# EAGLE design all (EAGLE 7.7.0)
AUTHOR: Pero Krivic

## Sheet 1 of 2
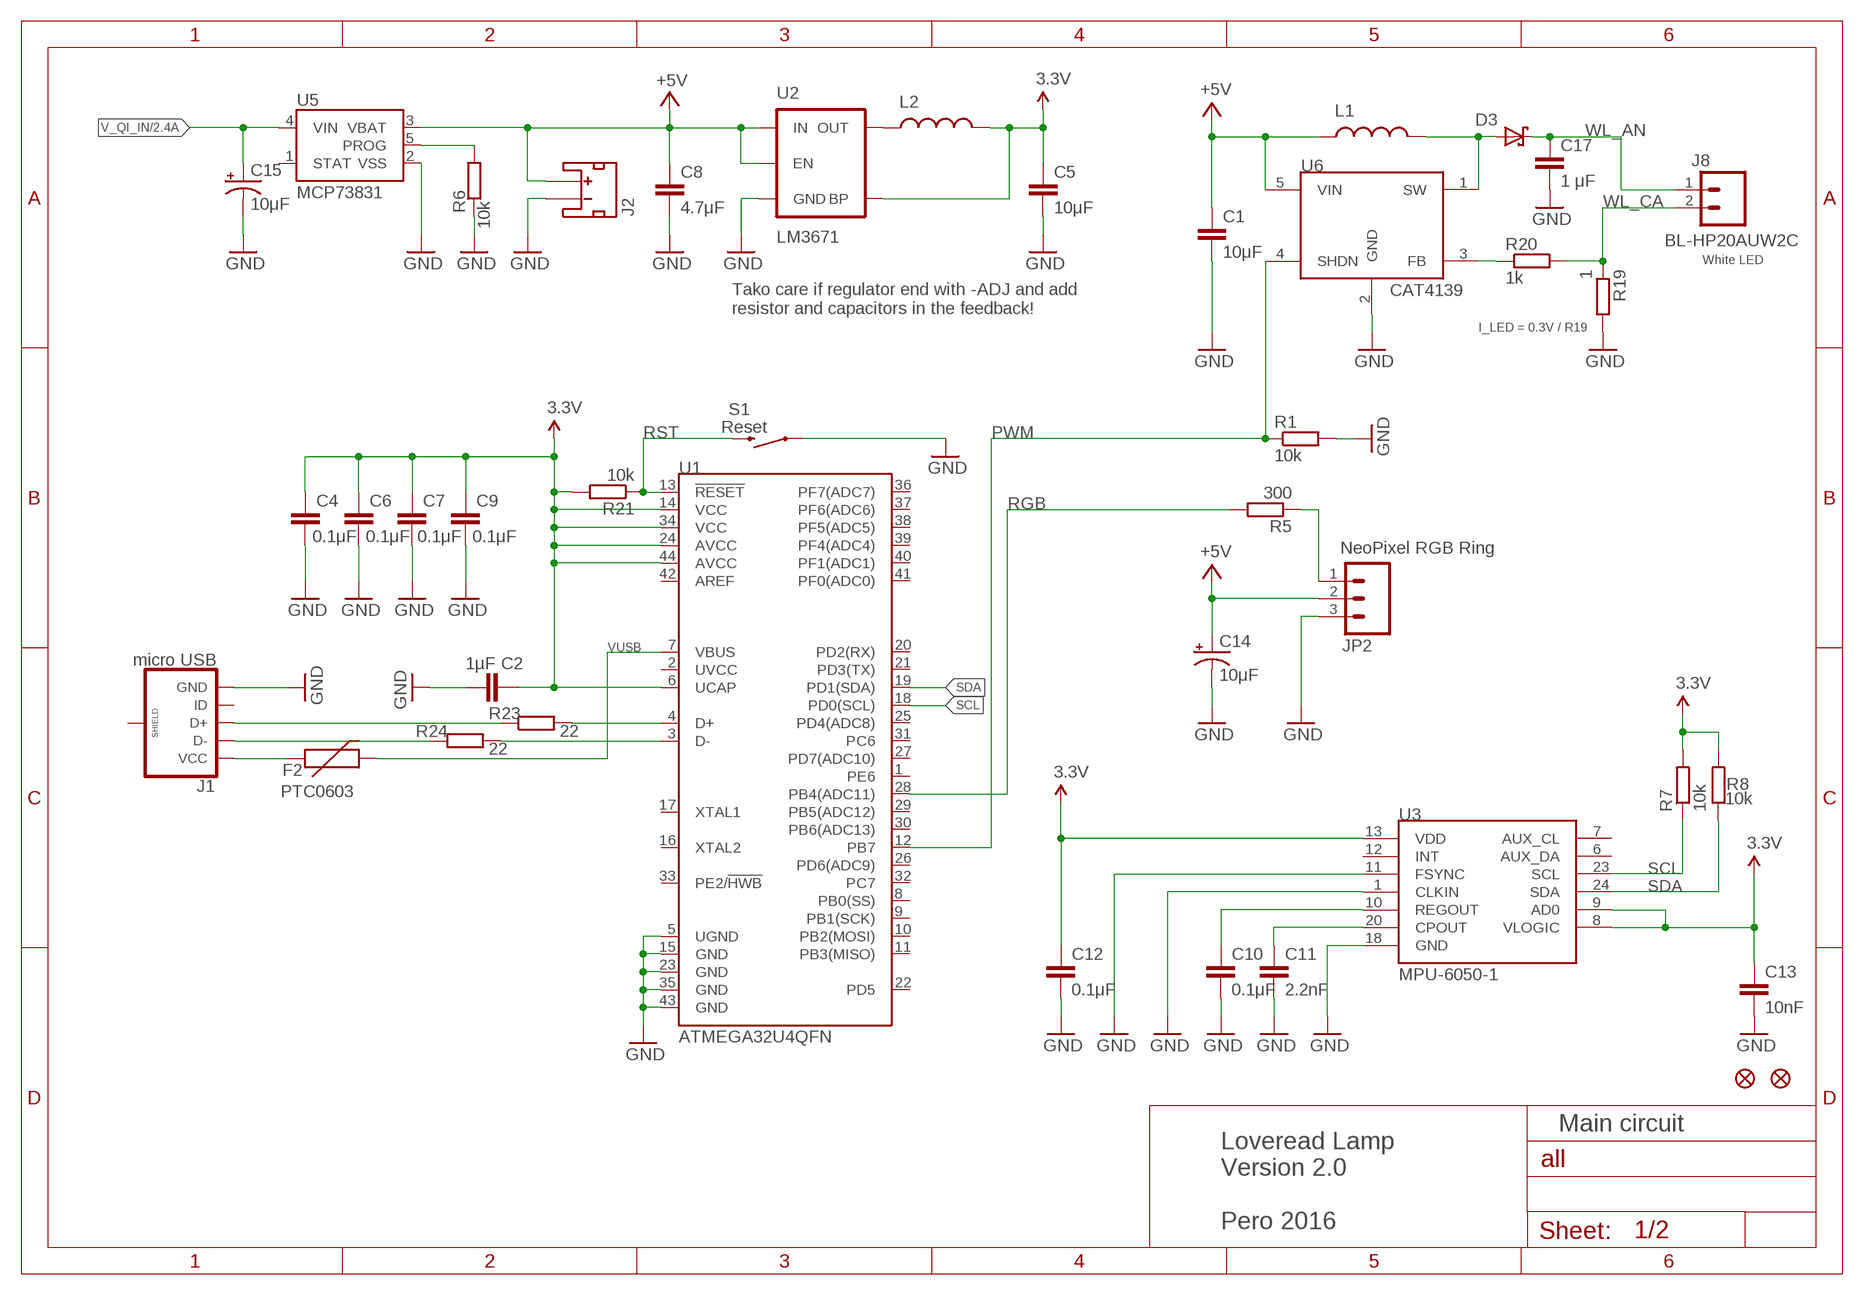
[diagram p0: schematic, sheet 1]

### Parts
C1  10μF  C-EUC0603K  [C0603K]
C2  1µF  C-EUC0603  [C0603]
C4  0.1μF  C-EUC0603K  [C0603K]
C5  10μF  C-EUC0603K  [C0603K]
C6  0.1μF  C-EUC0603K  [C0603K]
C7  0.1μF  C-EUC0603K  [C0603K]
C8  4.7μF  C-EUC0603K  [C0603K]
C9  0.1μF  C-EUC0603K  [C0603K]
C10  0.1μF  C-EUC0603K  [C0603K]
C11  2.2nF  C-EUC0603K  [C0603K]
C12  0.1μF  C-EUC0603K  [C0603K]
C13  10nF  C-EUC0603K  [C0603K]
C14  10μF  CAP_POL1206  [EIA3216]
C15  10μF  CAP_POL1206  [EIA3216]
C17  1 μF  C-EUC0603K  [C0603K]
D3  SMF5.0AT1  [SOD123FL]
F2  PTC0603  [0603]
FD1  FIDUCIAL1X2  [FIDUCIAL-1X2]
FD2  FIDUCIAL1X2  [FIDUCIAL-1X2]
J1  micro USB  USB_MICROB_PLUGCONN-11752  [USB-B-MICRO-SMD_V03]
J2  LIPO-BATTERY-CONNECTOR  [JST-LIPO-CONNECTOR-1.25MM]
J8  BL-HP20AUW2C  M02PTH  [1X02]
JP2  NeoPixel RGB Ring  M03PTH  [1X03]
L1  22uH  INDUCTORSDR0403-560KL  [SDR0403]
L2  2.2uH  INDUCTORSDR0403-560KL  [SDR0403]
R1  10k  R-EU_R0603  [R0603]
R5  300  R-EU_R0603  [R0603]
R6  10k  R-EU_R0603  [R0603]
R7  10k  R-EU_R0603  [R0603]
R8  10k  R-EU_R0603  [R0603]
R19  1  R-EU_R0603  [R0603]
R20  1k  R-EU_R0603  [R0603]
R21  10k  R-EU_R0603  [R0603]
R23  22  R-EU_R0603  [R0603]
R24  22  R-EU_R0603  [R0603]
S1  Reset  SWITCH-BUTTON-SKSGAAE010  [TACTILE-SWITCH-SKSGAAE010]
U1  ATMEGA32U4QFN  [QFN-44]
U2  LM3671  LM36713.3V  [SOT23-5]
U3  MPU-6050-1  [QFN-24-4MM2]
U5  MCP73831  [SOT23-5]
U6  CAT4139  [SOT23-5]

### Nets
3.3V: C2.1 C4.1 C5.1 C6.1 C7.1 C9.1 C12.1 C13.1 L2.P$2 R7.2 R8.2 R21.2 U1.6(UCAP) U1.14(VCC) U1.24(AVCC) U1.34(VCC) U1.44(AVCC) U2.4(BP) U3.8(VLOGIC) U3.9(AD0) U3.13(VDD)
+5V: C1.1 C8.1 C14.A(+) J2.P$1(+) JP2.2 L1.P$1 U2.1(IN) U2.3(EN) U5.3(VBAT) U6.5(VIN)
GND: C1.2 C2.2 C4.2 C5.2 C6.2 C7.2 C8.2 C9.2 C10.2 C11.2 C12.2 C13.2 C14.C(-) C15.C(-) C17.2 J1.GND J2.P$2(-) JP2.3 R1.2 R6.1 R19.2 S1.P$1 S1.P$3 U1.5(UGND) U1.15(GND) U1.23(GND) U1.35(GND) U1.43(GND) U2.2(GND) U3.1(CLKIN) U3.11(FSYNC) U3.18(GND) U5.2(VSS) U6.2(GND) ; also sheet 2
N$1: C11.1 U3.20(CPOUT)
N$5: C10.1 U3.10(REGOUT)
N$15: JP2.1 R5.1
N$17: R6.2 U5.5(PROG)
N$63: D3.A L1.P$2 U6.1(SW)
N$65: R20.1 U6.3(FB)
N$66: L2.P$1 U2.5(OUT)
N$73: F2.1 J1.VBUS(VCC)
N$74: J1.D+ R23.1
N$78: J1.D- R24.1
N$80: R23.2 U1.4(D+)
N$81: R24.2 U1.3(D-)
PWM: R1.1 U1.12(PB7) U6.4(SHDN)
RGB: R5.2 U1.28(PB4(ADC11))
RST: R21.1 S1.P$2 S1.P$4 U1.13(!RESET)
SCL: R7.1 U1.18(PD0(SCL)) U3.23(SCL)
SDA: R8.1 U1.19(PD1(SDA)) U3.24(SDA)
V_QI_IN: C15.A(+) U5.4(VIN) ; also sheet 2
VUSB: F2.2 U1.7(VBUS)
WL_AN: C17.1 D3.C J8.1
WL_CA: J8.2 R19.1 R20.2
Unconnected: J1.ID J1.SHIELD1(SHIELD) J1.SHIELD2(SHIELD) J1.SHIELD3(SHIELD) J2.P$3(PAD1) J2.P$4(PAD2) U1.1(PE6) U1.2(UVCC) U1.8(PB0(SS)) U1.9(PB1(SCK)) U1.10(PB2(MOSI)) U1.11(PB3(MISO)) U1.16(XTAL2) U1.17(XTAL1) U1.20(PD2(RX)) U1.21(PD3(TX)) U1.22(PD5) U1.25(PD4(ADC8)) U1.26(PD6(ADC9)) U1.27(PD7(ADC10)) U1.29(PB5(ADC12)) U1.30(PB6(ADC13)) U1.31(PC6) U1.32(PC7) U1.33(PE2/!HWB) U1.36(PF7(ADC7)) U1.37(PF6(ADC6)) U1.38(PF5(ADC5)) U1.39(PF4(ADC4)) U1.40(PF1(ADC1)) U1.41(PF0(ADC0)) U1.42(AREF) U3.6(AUX_DA) U3.7(AUX_CL) U3.12(INT) U5.1(STAT)

### Notes on the sheet
- White LED
- Tako care if regulator end with -ADJ and add
  resistor and capacitors in the feedback!
- I_LED = 0.3V / R19
- Main circuit
- Loveread Lamp
  Version 2.0
  
  Pero 2016

## Sheet 2 of 2
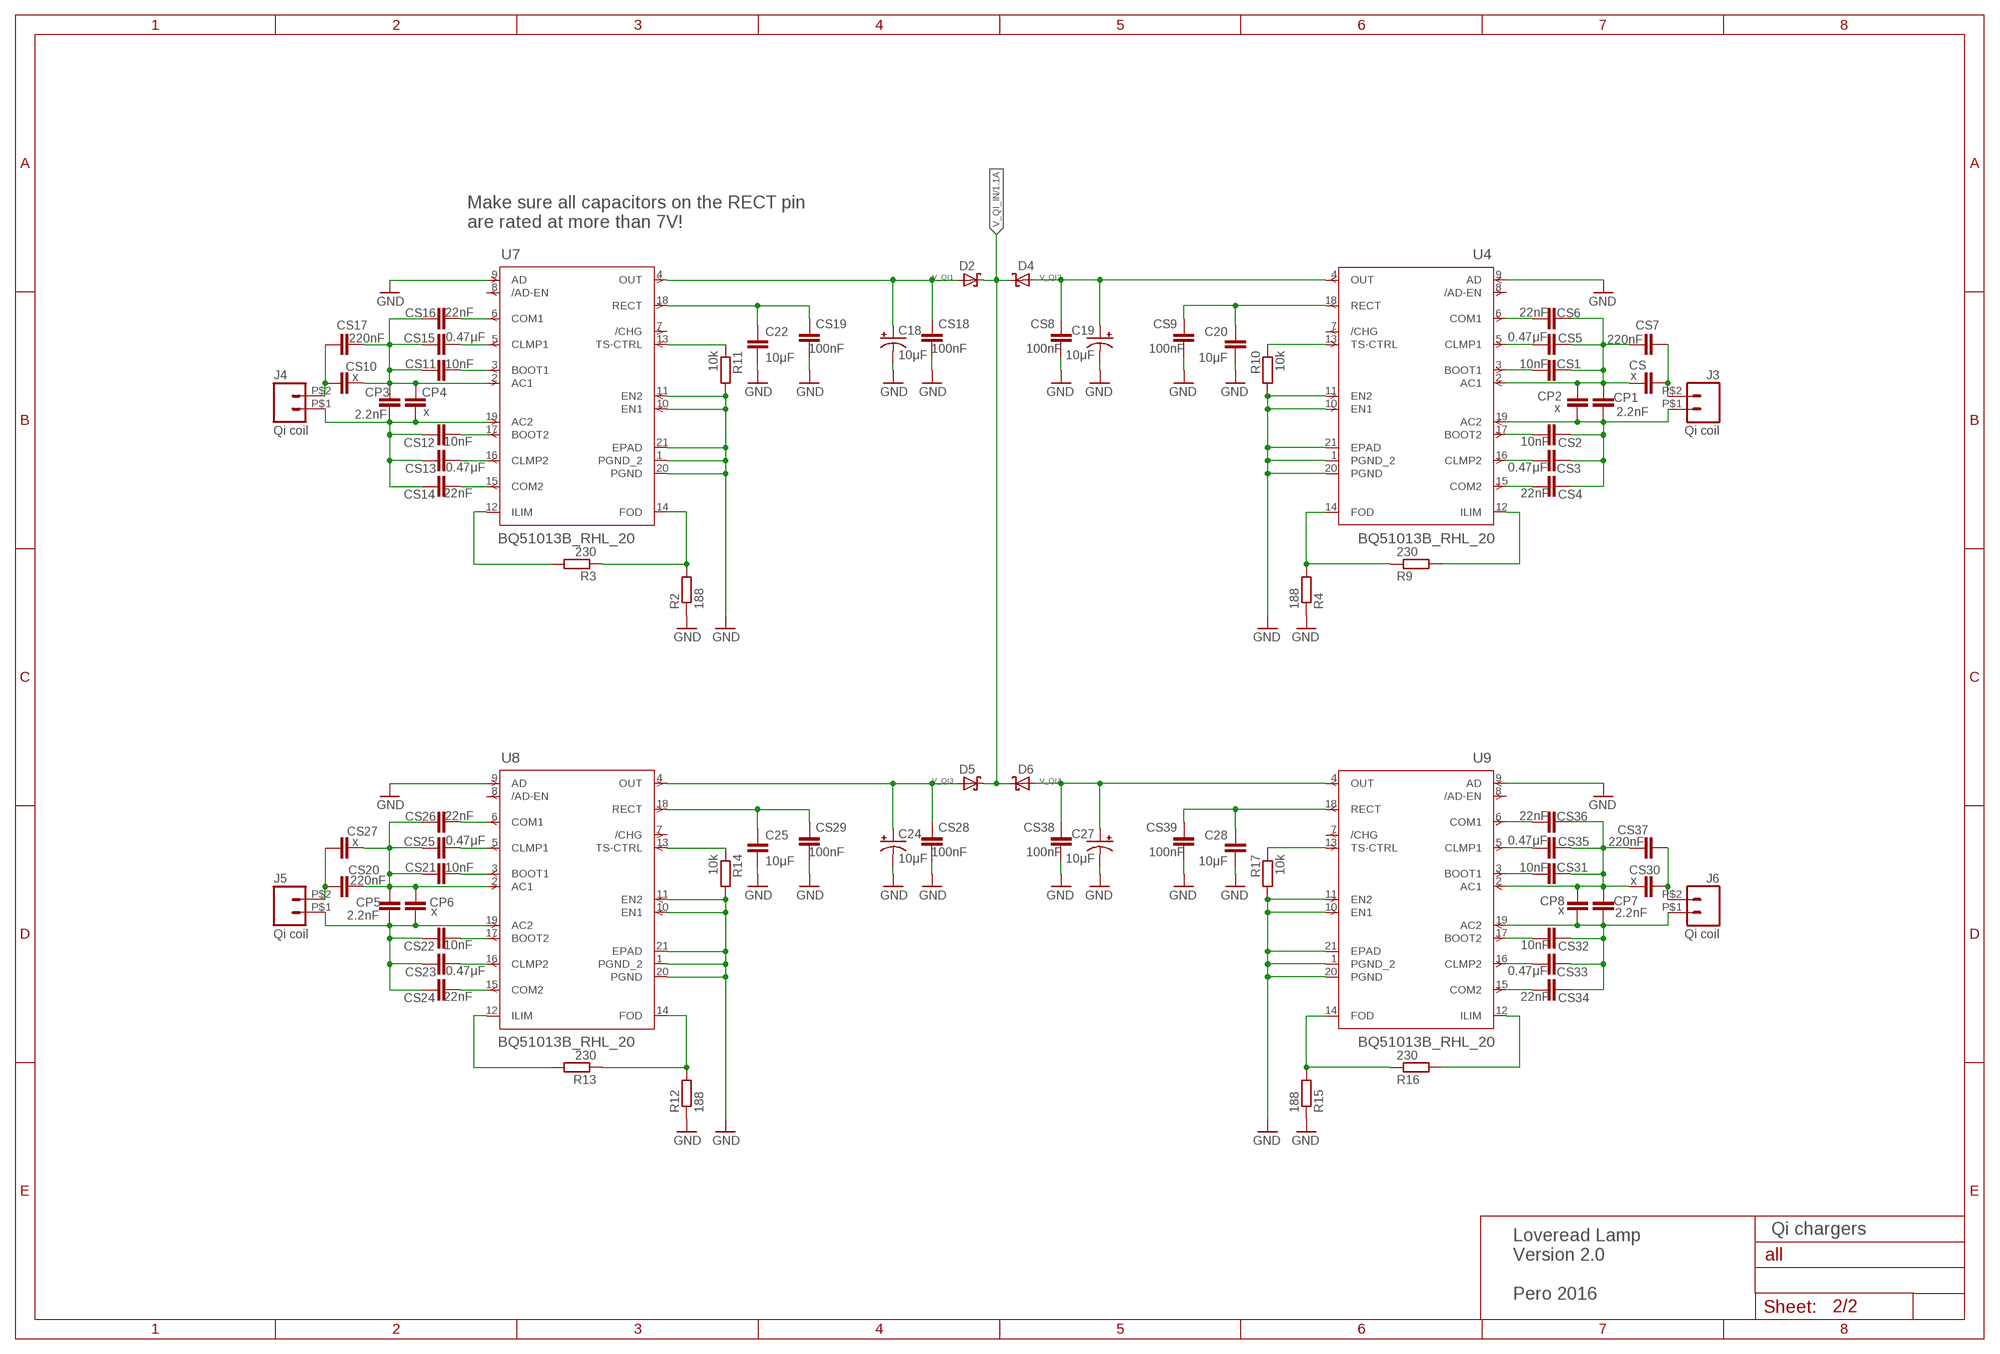
[diagram p1: schematic, sheet 2]

### Parts
C18  10μF  CAP_POL1206  [EIA3216]
C19  10μF  CAP_POL1206  [EIA3216]
C20  10μF  C-EUC0603K  [C0603K]
C22  10μF  C-EUC0603K  [C0603K]
C24  10μF  CAP_POL1206  [EIA3216]
C25  10μF  C-EUC0603K  [C0603K]
C27  10μF  CAP_POL1206  [EIA3216]
C28  10μF  C-EUC0603K  [C0603K]
CP1  2.2nF  C-EUC0603K  [C0603K]
CP2  x  C-EUC0603K  [C0603K]
CP3  2.2nF  C-EUC0603K  [C0603K]
CP4  x  C-EUC0603K  [C0603K]
CP5  2.2nF  C-EUC0603K  [C0603K]
CP6  x  C-EUC0603K  [C0603K]
CP7  2.2nF  C-EUC0603K  [C0603K]
CP8  x  C-EUC0603K  [C0603K]
CS  x  C-EUC0603K  [C0603K]
CS1  10nF  C-EUC0603K  [C0603K]
CS2  10nF  C-EUC0603K  [C0603K]
CS3  0.47μF  C-EUC0603K  [C0603K]
CS4  22nF  C-EUC0603K  [C0603K]
CS5  0.47μF  C-EUC0603K  [C0603K]
CS6  22nF  C-EUC0603K  [C0603K]
CS7  220nF  C-EUC0603K  [C0603K]
CS8  100nF  C-EUC0603K  [C0603K]
CS9  100nF  C-EUC0603K  [C0603K]
CS10  x  C-EUC0603K  [C0603K]
CS11  10nF  C-EUC0603K  [C0603K]
CS12  10nF  C-EUC0603K  [C0603K]
CS13  0.47μF  C-EUC0603K  [C0603K]
CS14  22nF  C-EUC0603K  [C0603K]
CS15  0.47μF  C-EUC0603K  [C0603K]
CS16  22nF  C-EUC0603K  [C0603K]
CS17  220nF  C-EUC0603K  [C0603K]
CS18  100nF  C-EUC0603  [C0603]
CS19  100nF  C-EUC0603K  [C0603K]
CS20  220nF  C-EUC0603K  [C0603K]
CS21  10nF  C-EUC0603K  [C0603K]
CS22  10nF  C-EUC0603K  [C0603K]
CS23  0.47μF  C-EUC0603K  [C0603K]
CS24  22nF  C-EUC0603K  [C0603K]
CS25  0.47μF  C-EUC0603K  [C0603K]
CS26  22nF  C-EUC0603K  [C0603K]
CS27  x  C-EUC0603K  [C0603K]
CS28  100nF  C-EUC0603K  [C0603K]
CS29  100nF  C-EUC0603K  [C0603K]
CS30  x  C-EUC0603K  [C0603K]
CS31  10nF  C-EUC0603K  [C0603K]
CS32  10nF  C-EUC0603K  [C0603K]
CS33  0.47μF  C-EUC0603K  [C0603K]
CS34  22nF  C-EUC0603K  [C0603K]
CS35  0.47μF  C-EUC0603K  [C0603K]
CS36  22nF  C-EUC0603K  [C0603K]
CS37  220nF  C-EUC0603K  [C0603K]
CS38  100nF  C-EUC0603K  [C0603K]
CS39  100nF  C-EUC0603K  [C0603K]
D2  SMF5.0AT1  [SOD123FL]
D4  SMF5.0AT1  [SOD123FL]
D5  SMF5.0AT1  [SOD123FL]
D6  SMF5.0AT1  [SOD123FL]
J3  Qi coil  M02PTH2  [1X02_BIG]
J4  Qi coil  M02PTH2  [1X02_BIG]
J5  Qi coil  M02PTH2  [1X02_BIG]
J6  Qi coil  M02PTH2  [1X02_BIG]
R2  188  R-EU_R0603  [R0603]
R3  230  R-EU_R0603  [R0603]
R4  188  R-EU_R0603  [R0603]
R9  230  R-EU_R0603  [R0603]
R10  10k  R-EU_R0603  [R0603]
R11  10k  R-EU_R0603  [R0603]
R12  188  R-EU_R0603  [R0603]
R13  230  R-EU_R0603  [R0603]
R14  10k  R-EU_R0603  [R0603]
R15  188  R-EU_R0603  [R0603]
R16  230  R-EU_R0603  [R0603]
R17  10k  R-EU_R0603  [R0603]
U4  BQ51013B_RHL_20  [RHL20_2P05X3P05]
U7  BQ51013B_RHL_20  [RHL20_2P05X3P05]
U8  BQ51013B_RHL_20  [RHL20_2P05X3P05]
U9  BQ51013B_RHL_20  [RHL20_2P05X3P05]

### Nets
GND: C18.C(-) C19.C(-) C20.2 C22.2 C24.C(-) C25.2 C27.C(-) C28.2 CS8.2 CS9.2 CS18.2 CS19.2 CS28.2 CS29.2 CS38.2 CS39.2 R2.1 R4.1 R10.2 R11.2 R12.1 R14.2 R15.1 R17.2 U4.1(PGND_2) U4.9(AD) U4.10(EN1) U4.11(EN2) U4.20(PGND) U4.21(EPAD) U7.1(PGND_2) U7.9(AD) U7.10(EN1) U7.11(EN2) U7.20(PGND) U7.21(EPAD) U8.1(PGND_2) U8.9(AD) U8.10(EN1) U8.11(EN2) U8.20(PGND) U8.21(EPAD) U9.1(PGND_2) U9.9(AD) U9.10(EN1) U9.11(EN2) U9.20(PGND) U9.21(EPAD) ; also sheet 1
N$6: CS10.1 CS17.1 J4.P$2
N$8: CP3.1 CP4.1 CS12.1 CS13.1 CS14.1 J4.P$1 U7.19(AC2)
N$9: CP1.2 CP2.2 CS1.1 CS5.1 CS6.1 CS7.2 CS.2 U4.2(AC1)
N$10: CS7.1 CS.1 J3.P$2
N$11: CP1.1 CP2.1 CS2.1 CS3.1 CS4.1 J3.P$1 U4.19(AC2)
N$12: CS1.2 U4.3(BOOT1)
N$13: CS2.2 U4.17(BOOT2)
N$14: CS3.2 U4.16(CLMP2)
N$16: CS11.2 U7.3(BOOT1)
N$19: CS4.2 U4.15(COM2)
N$20: CS6.2 U4.6(COM1)
N$21: CS5.2 U4.5(CLMP1)
N$22: CS12.2 U7.17(BOOT2)
N$23: C20.1 CS9.1 U4.18(RECT)
N$24: R9.2 U4.12(ILIM)
N$25: R4.2 R9.1 U4.14(FOD)
N$26: R10.1 U4.13(TS-CTRL)
N$27: CS13.2 U7.16(CLMP2)
N$28: CS14.2 U7.15(COM2)
N$29: CS16.2 U7.6(COM1)
N$30: CS15.2 U7.5(CLMP1)
N$31: CP3.2 CP4.2 CS10.2 CS11.1 CS15.1 CS16.1 CS17.2 U7.2(AC1)
N$32: C22.1 CS19.1 U7.18(RECT)
N$33: R3.2 U7.12(ILIM)
N$34: R2.2 R3.1 U7.14(FOD)
N$35: R11.1 U7.13(TS-CTRL)
N$36: CS20.1 CS27.1 J5.P$2
N$37: CP5.1 CP6.1 CS22.1 CS23.1 CS24.1 J5.P$1 U8.19(AC2)
N$38: CS21.2 U8.3(BOOT1)
N$39: CS22.2 U8.17(BOOT2)
N$40: CS23.2 U8.16(CLMP2)
N$41: CS24.2 U8.15(COM2)
N$42: CS26.2 U8.6(COM1)
N$43: CS25.2 U8.5(CLMP1)
N$44: CP5.2 CP6.2 CS20.2 CS21.1 CS25.1 CS26.1 CS27.2 U8.2(AC1)
N$45: C25.1 CS29.1 U8.18(RECT)
N$46: R13.2 U8.12(ILIM)
N$47: R12.2 R13.1 U8.14(FOD)
N$48: R14.1 U8.13(TS-CTRL)
N$49: CS30.1 CS37.1 J6.P$2
N$50: CP7.1 CP8.1 CS32.1 CS33.1 CS34.1 J6.P$1 U9.19(AC2)
N$51: CS31.2 U9.3(BOOT1)
N$52: CS32.2 U9.17(BOOT2)
N$53: CS33.2 U9.16(CLMP2)
N$54: CS34.2 U9.15(COM2)
N$55: CS36.2 U9.6(COM1)
N$56: CS35.2 U9.5(CLMP1)
N$57: CP7.2 CP8.2 CS30.2 CS31.1 CS35.1 CS36.1 CS37.2 U9.2(AC1)
N$58: C28.1 CS39.1 U9.18(RECT)
N$59: R16.2 U9.12(ILIM)
N$60: R15.2 R16.1 U9.14(FOD)
N$61: R17.1 U9.13(TS-CTRL)
V_QI1: C18.A(+) CS18.1 D2.A U7.4(OUT)
V_QI2: C19.A(+) CS8.1 D4.A U4.4(OUT)
V_QI3: C24.A(+) CS28.1 D5.A U8.4(OUT)
V_QI4: C27.A(+) CS38.1 D6.A U9.4(OUT)
V_QI_IN: D2.C D4.C D5.C D6.C ; also sheet 1
Unconnected: U4.7(/CHG) U4.8(/AD-EN) U7.7(/CHG) U7.8(/AD-EN) U8.7(/CHG) U8.8(/AD-EN) U9.7(/CHG) U9.8(/AD-EN)

### Notes on the sheet
- Make sure all capacitors on the RECT pin
  are rated at more than 7V!
- Qi chargers
- Loveread Lamp
  Version 2.0
  
  Pero 2016

## Library data of the parts
C1 C2 C4-C13 C17 C20 C22 C25 C28 CP1-CP8 CS CS1-CS39 = rcl:C-EU: CAPACITOR, European symbol
C14 C15 C18 C19 C24 C27 = SparkFun:CAP_POL: Capacitor Polarized These are standard SMD and PTH capacitors. Normally 10uF, 47uF, and 100uF in electrolytic and tantalum varieties. Always verify the external diameter of the through hole cap, it varies with capacity, voltage, and manufacturer. The EIA devices should be standard.
D2-D6 = diode:SMF5.0AT1: 200 W Transient Voltage Suppressor Source: Data sheet <http://www.onsemi.com/pub_link/Collateral/SMF5.0AT1-D.PDF>
F2 = SparkFun-PowerIC:PTC: Resettable Fuse PTC Resettable Fuse. Spark Fun Electronics SKU : COM-08357
FD1 FD2 = SparkFun-Aesthetics:FIDUCIAL: Fiducial Alignment Points Various fiducial points for machine vision alignment.
J1 = SparkFun-Connectors:USB_MICROB_PLUG: USB Micro-B connectors Some male, some female. Watch your step!; PROD_ID: CONN-11752
J2 = pero_library:LIPO-BATTERY-CONNECTOR: LiPo Battery connector, 1 mm raster; MANUFACTURER: JST; RS-NUMBER: 752-1790; SUPPLIER-ID: SM02B-GHS-TB(LF)(SN)
J3-J6 J8 = SparkFun-Connectors:M02: Standard 2-pin 0.1" header. Use with - straight break away headers ( PRT-00116) - right angle break away headers (PRT-00553) - swiss pins (PRT-00743) - machine pins (PRT-00117) - female headers (PRT-00115) Molex polarized connector foot print use with: PRT-08233 with associated crimp pins and housings. 2.54_SCREWTERM for use with PRT-10571. 3.5mm Screw Terminal footprints for PRT-08084 5mm Screw Terminal footprints for use with PRT-08432
JP2 = SparkFun-Connectors:M03: Header 3 Standard 3-pin 0.1" header. Use with straight break away headers (SKU : PRT-00116), right angle break away headers (PRT-00553), swiss pins (PRT-00743), machine pins (PRT-00117), and female headers (PRT-00115). Molex polarized connector foot print use with SKU : PRT-08232 with associated crimp pins and housings.
L1 L2 = SparkFun-Passives:INDUCTOR: Inductors Basic Inductor/Choke - 0603 and 1206. Footprints are not proven and vary greatly between part numbers. INDUCTOR POWER 3.3UH 4.0A SMD 0.197" L x 0.197" W x 0.177" H (5.00mm x 5.00mm x 4.50mm); DIST: DIGIKEY; DIST_ID: SDR0403-560KLCT-ND; VALUE: 56uH
R1 R19 R20 = resistor:R-EU_: RESISTOR, European symbol
R2-R17 R21 R23 R24 = rcl:R-EU_: RESISTOR, European symbol
S1 = pero_library:SWITCH-BUTTON-SKSGAAE010: 1-Pole Switch-button SKSGAAE010 Dimensions: 3 x 2.7mm Max. current: 50 mA; MANUFACTURER: Alps; PRODUCT-ID: SKSGAAE010; RS-NUMBER: 917-3829
U1 = SparkFun-DigitalIC:ATMEGA32U4: Atmel 44-pin 8-bit Microcontroller with 32KBytes of ISP Flash and USB Controller
U2 = pero_library:LM3671: LM3671/-Q1 2-MHz, 600-mA Step-Down DC-DC Converter; MANUFACTURER: Texas Instruments; PROD_ID: VREG-00822; RS-NUMBER: 537-9547
U3 = Testing:MPU-6050
U4 U7-U9 = pero_library:BQ51013B_RHL_20; DATASHEETURL: http://www.ti.com/lit/gpn/BQ51013B; DESCRIPTION: WPC 1.1 Compatible Fully Integrated Wireless Power Receiver IC; FAMILY_NAME: Wireless Power - Receiver Solutions; GENERIC_PART_NUMBER: BQ51013B; INDUSTRY_STD_PKG_TYPE: QFN; MANUFACTURER: Texas Instruments; MANUFACTURER_PART_NUMBER: bq51013b_rhl_20; PACKAGE_DESIGNATOR: RHL; PIN_COUNT: 20; VENDOR: Texas Instruments
U5 = SparkFun-PowerIC:MCP73831: Miniature single cell, fully integrated Li-Ion, Li-polymer charge management controller http://ww1.microchip.com/downloads/en/DeviceDoc/20001984g.pdf IC-09995; PROD_ID: IC-09995
U6 = pero_library:CAT4139: The CAT4139 is a DC/DC step−up converter that delivers an accurate constant current ideal for driving LEDs. • Switch Current Limit 750 mA • Drives LED Strings up to 22 V • Up to 87% Efficiency • Low Quiescent Ground Current 0.6 mA • 1 MHz Fixed Frequency Low Noise Operation • Soft Start “In−rush” Current Limiting • Shutdown Current Less than 1 A • Open LED Overvoltage Protection • Automatic Shutdown at 1.9 V (UVLO) • Thermal Overload Protection • TSOT−23 5−Lead (1 mm Max Height) • These Devices are Pb−Free, Halogen Free/BFR Free and are RoHS Compliant; MANUFACTURER: On Semiconductor; RS-NUMBER: 789-3840

## Board
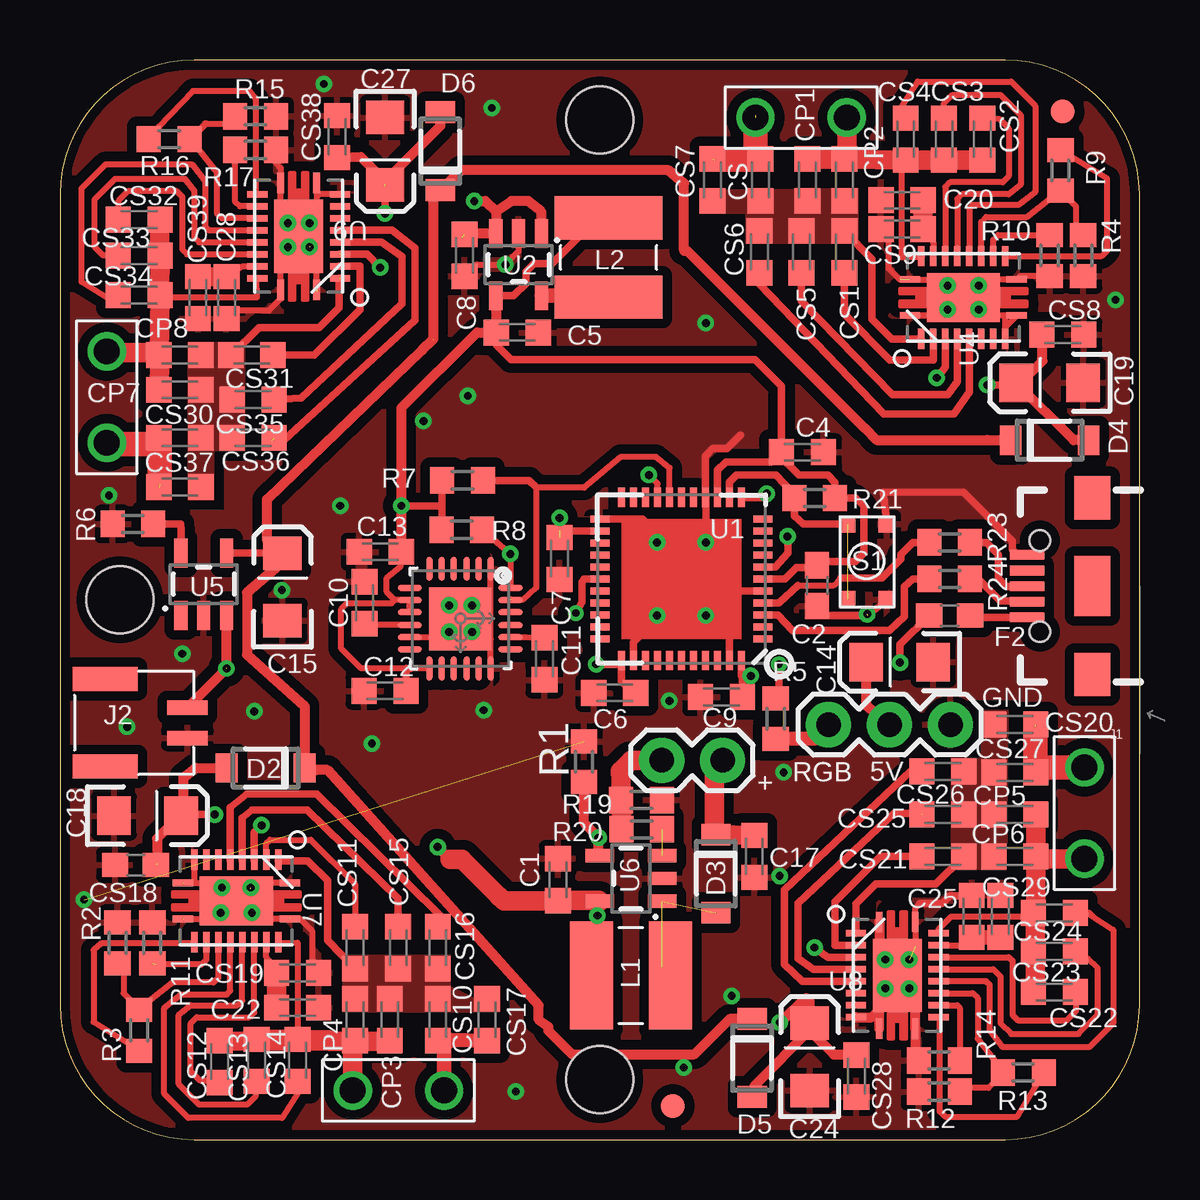
[diagram p2: board, top side]
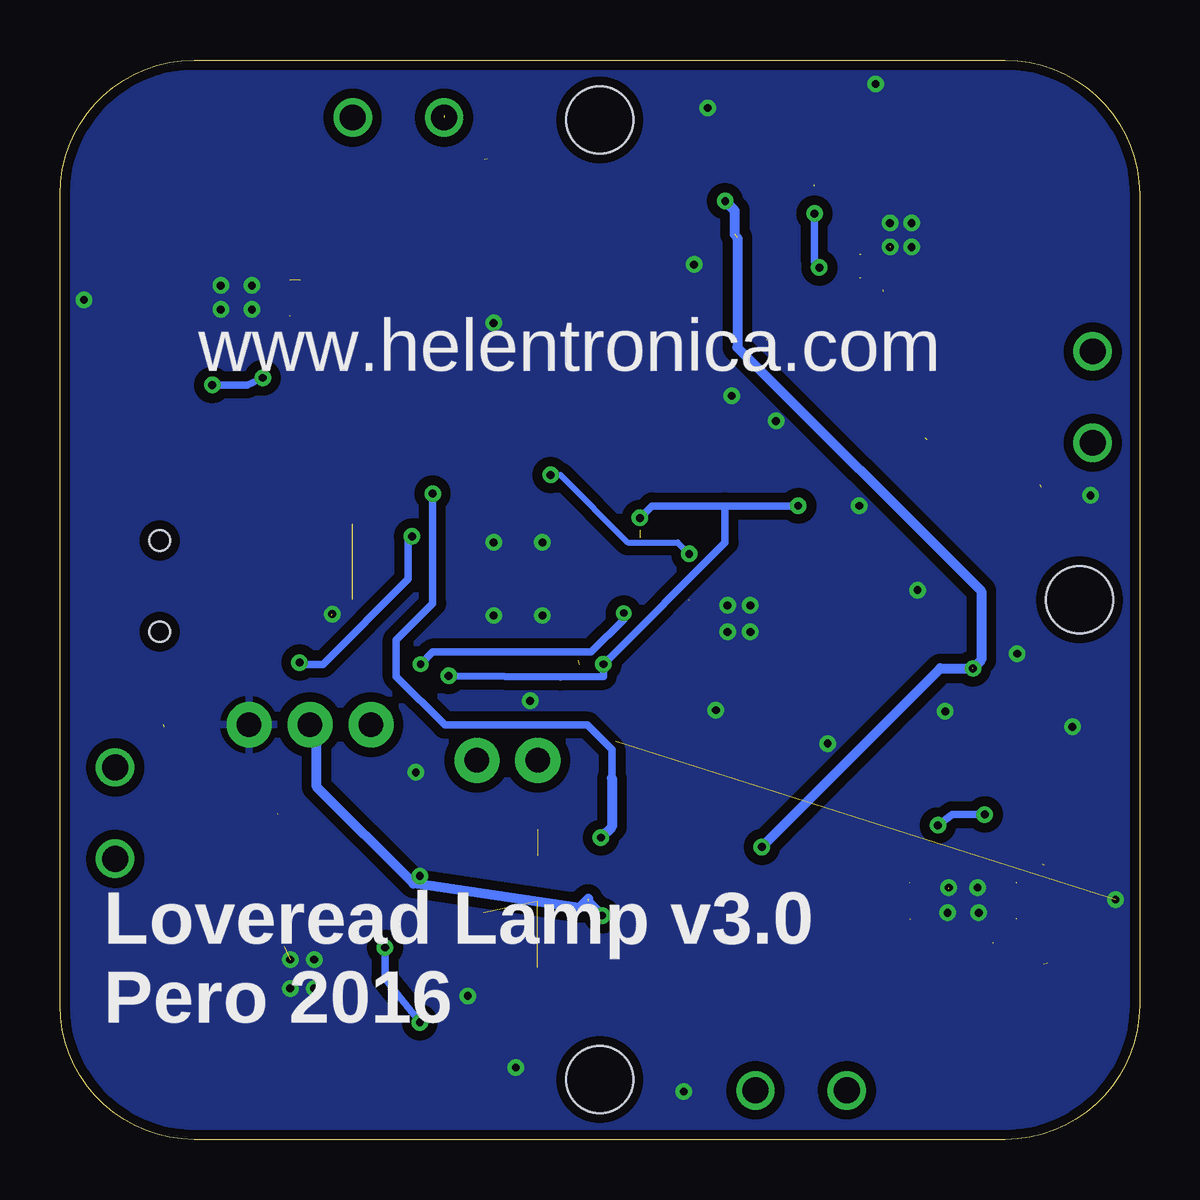
[diagram p3: board, bottom side, seen from below]

Size 45 x 45 mm. Coordinates in mm from the lower left corner, seen from the top.
Outline: 5.59,0 39.41,0 arc90 45,5.59 45,39.41 arc90 39.41,45 5.59,45 arc90 0,39.41 0,5.59 arc90 5.59,0
Copper layers (1*16): Top 0.0356mm / dielectric 1.5011mm / Bottom 0.0356mm
Design rules "LaenPCBOrder": minimum track width 6mil, minimum drill 13mil, track to track 6mil, track to pad 6mil, pad to pad 6mil, via to via 6mil, smd to smd 6mil, copper to edge 15mil, drill to drill 6mil, minimum pad ring 7mil, minimum via ring 7mil, stop-mask expansion 3mil, vias tented up to drill 0mil, thermal gap 10mil
Holes 2.8 mm at 22.5,2.5 22.5,42.5 2.5,22.5

### Footprints (pad centres in the part's own frame; a part is rotated, then mirrored left to right if it is on the bottom)
C0603K = smd 1.05 x 1.08: 1 -0.875,0; 2 0.875,0
C0603 = smd 1.1 x 1: 1 -0.85,0; 2 0.85,0
EIA3216 = smd 1.4 x 1.6: A 1.4,0; C -1.4,0
SOD123FL = smd 0.91 x 1.22: A 1.625,0; C -1.625,0
0603 = smd 1.1 x 1: 1 -0.85,0; 2 0.85,0
FIDUCIAL-1X2 = smd 1 x 1: 1 0,0
USB-B-MICRO-SMD_V03 = smd 1.45 x 0.4: D+ 2.725,0; D- 2.725,0.65; GND 2.725,-1.3; ID 2.725,-0.65; VBUS 2.725,1.3 | smd 1.5 x 1.8: SHIELD1 0,3.685; SHIELD2 0,-3.685 | smd 1.5 x 2.5: SHIELD3 0,0 | hole 0.85: 2.2,1.9; 2.2,-1.9
JST-LIPO-CONNECTOR-1.25MM = smd 0.6 x 1.7: P$1 -0.635,0.889; P$2 0.635,0.889 | smd 1 x 2.7: P$3 1.825,-2.54; P$4 -1.825,-2.54
1X02_BIG = drill 1.067: P$1 0,0; P$2 3.81,0
1X02 = drill 1.016 pad 1.88: 1 0,0; 2 2.54,0
1X03 = drill 1.016 pad 1.88: 1 0,0; 2 2.54,0; 3 5.08,0
SDR0403 = smd 1.8 x 4.5: P$1 -1.65,0; P$2 1.65,0
R0603 = smd 1 x 1.1: 1 -0.85,0; 2 0.85,0
TACTILE-SWITCH-SKSGAAE010 = smd 0.7 x 0.7: P$1 -1.55,0.85; P$2 -1.55,-0.8; P$3 1.6,0.85; P$4 1.6,-0.8
QFN-44 = smd 0.8 x 0.3: 1 -3.4,2.5; 2 -3.4,2; 3 -3.4,1.5; 4 -3.4,1; 5 -3.4,0.5; 6 -3.4,0; 7 -3.4,-0.5; 8 -3.4,-1; 9 -3.4,-1.5; 10 -3.4,-2; 11 -3.4,-2.5; 23 3.4,-2.5; 24 3.4,-2; 25 3.4,-1.5; 26 3.4,-1; 27 3.4,-0.5; 28 3.4,0; 29 3.4,0.5; 30 3.4,1; 31 3.4,1.5; 32 3.4,2; 33 3.4,2.5 | smd 0.3 x 0.8: 12 -2.5,-3.4; 13 -2,-3.4; 14 -1.5,-3.4; 15 -1,-3.4; 16 -0.5,-3.4; 17 0,-3.4; 18 0.5,-3.4; 19 1,-3.4; 20 1.5,-3.4; 21 2,-3.4; 22 2.5,-3.4; 34 2.5,3.4; 35 2,3.4; 36 1.5,3.4; 37 1,3.4; 38 0.5,3.4; 39 0,3.4; 40 -0.5,3.4; 41 -1,3.4; 42 -1.5,3.4; 43 -2,3.4; 44 -2.5,3.4
SOT23-5 = smd 0.55 x 1.2: 1 -0.95,-1.3; 2 0,-1.3; 3 0.95,-1.3; 4 0.95,1.3; 5 -0.95,1.3
QFN-24-4MM2 = smd 1.016 x 0.254: 1 -2.066,1.257; 2 -2.066,0.75; 3 -2.066,0.247; 4 -2.066,-0.287; 5 -2.066,-0.792; 6 -2.066,-1.297; 13 2.086,-1.297; 14 2.086,-0.792; 15 2.086,-0.287; 16 2.086,0.247; 17 2.086,0.75; 18 2.086,1.257 | smd 0.254 x 1.016: 7 -1.267,-2.122; 8 -0.762,-2.122; 9 -0.258,-2.122; 10 0.278,-2.122; 11 0.78,-2.122; 12 1.287,-2.122; 19 1.287,2.082; 20 0.78,2.082; 21 0.278,2.082; 22 -0.258,2.082; 23 -0.762,2.082; 24 -1.267,2.082 | smd 2.616 x 2.616: P$1 0.02,-0.01
RHL20_2P05X3P05 = smd 0.28 x 0.85: 1 -0.75,2.225; 10 -0.75,-2.225; 11 0.75,-2.225; 20 0.75,2.225; 22 -0.75,-2.225 | smd 0.85 x 0.28: 2 -1.725,1.75; 3 -1.725,1.25; 4 -1.725,0.75; 5 -1.725,0.25; 6 -1.725,-0.25; 7 -1.725,-0.75; 8 -1.725,-1.25; 9 -1.725,-1.75; 12 1.725,-1.75; 13 1.725,-1.25; 14 1.725,-0.75; 15 1.725,-0.25; 16 1.725,0.25; 17 1.725,0.75; 18 1.725,1.25; 19 1.725,1.75 | smd 2.05 x 3.05: 21 0,0

### Placement (x,y rotation side)
C1  20.76,10.83 90 top
C2  31.55,23.09 270 top
C4  30.95,28.65 0 top
C5  19.06,33.64 0 top
C6  23.13,18.62 180 top
C7  20.82,24.22 270 top
C8  16.87,36.86 270 top
C9  27.58,18.44 180 top
C10  12.69,22.38 90 top
C11  20.2,20.04 270 top
C12  13.56,18.7 180 top
C13  13.35,24.5 180 top
C14  35,19.9 180 top
C15  9.28,23.03 90 top
C17  28.94,11.8 270 top
C18  3.65,13.5 0 top
C19  41.25,31.55 180 top
C20  35.1,39.15 180 top
C22  9.9,5.5 0 top
C24  31.25,3.45 90 top
C25  38,9.3 90 top
C27  13.55,41.2 270 top
C28  6.95,35.1 270 top
CP1  31.15,40 270 top
CP2  32.7,40 270 top
CP3  13.75,5 90 top
CP4  12.3,5 90 top
CP5  39.8,13.55 180 top
CP6  39.8,11.8 180 top
CP7  5,31.25 0 top
CP8  5,32.7 0 top
CS  29.2,40 270 top
CS1  32.7,37 270 top
CS2  38.45,41.7 90 top
CS3  36.85,41.7 90 top
CS4  35.25,41.7 90 top
CS5  30.9,37 270 top
CS6  29.15,37 270 top
CS7  27.2,40 270 top
CS8  41.8,33.55 0 top
CS9  35.1,37.95 180 top
CS10  15.75,5 90 top
CS11  12.3,8 90 top
CS12  6.65,3.25 270 top
CS13  8.2,3.3 270 top
CS14  9.9,3.3 270 top
CS15  14.1,8 90 top
CS16  15.75,8 90 top
CS17  17.8,5 90 top
CS18  3.15,11.45 180 top
CS19  9.9,6.95 0 top
CS20  39.8,17.3 180 top
CS21  36.8,11.8 180 top
CS22  41.45,6.15 0 top
CS23  41.45,7.85 0 top
CS24  41.45,9.45 0 top
CS25  36.8,13.55 180 top
CS26  36.8,15.35 180 top
CS27  39.8,15.3 180 top
CS28  33.2,2.65 270 top
CS29  39.2,9.3 90 top
CS30  5,29.25 0 top
CS31  8,32.7 0 top
CS32  3.3,38.35 180 top
CS33  3.3,36.85 180 top
CS34  3.3,35.2 180 top
CS35  8.05,30.85 0 top
CS36  8.05,29.25 0 top
CS37  5,27.2 0 top
CS38  11.55,41.8 90 top
CS39  5.75,35.1 270 top
D2  8.58,15.49 180 top
D3  27.34,11.08 270 top
D4  41.25,29.15 0 top
D5  28.85,3.4 270 top
D6  15.85,41.2 90 top
DRILEGEND  [DRILEGEND]  75.48,17.17 0 top  (outside the outline)
F2  37.08,21.84 180 top
FD1  41.8,42.85 0 top
FD2  25.55,1.4 0 top
J1  43.04,23.07 180 top
J2  4.42,17.37 270 top
J3  32.8,42.6 180 top
J4  12.2,2.05 0 top
J5  42.7,11.7 90 top
J6  1.95,32.85 270 top
J8  27.62,15.81 180 top
JP2  32.04,17.29 0 top
L1  23.8,6.83 0 top
L2  22.87,36.77 90 top
R1  21.84,15.75 90 top
R2  2.4,8.2 270 top
R3  3.3,4.55 270 top
R4  42.65,36.85 90 top
R5  29.83,17.54 90 top
R6  3.04,25.66 0 top
R7  16.78,27.48 180 top
R8  16.75,25.42 180 top
R9  41.7,40.4 90 top
R10  41.25,36.85 270 top
R11  3.85,8.2 90 top
R12  36.65,2 0 top
R13  40.15,2.8 0 top
R14  36.65,3.3 180 top
R15  8.15,42.65 180 top
R16  4.55,41.7 180 top
R17  8.15,41.25 0 top
R19  24.24,14.15 0 top
R20  24.25,12.93 180 top
R21  31.46,26.74 0 top
R23  37.08,24.89 180 top
R24  37.08,23.37 180 top
S1  33.61,24.11 270 top
U1  25.91,23.37 180 top
U2  19.12,36.47 180 top
U3  16.7,21.72 270 top
U4  37.65,35.1 90 top
U5  5.99,23.15 0 top
U6  23.8,10.88 90 top
U7  7.35,9.95 270 top
U8  34.9,6.85 0 top
U9  9.95,37.65 180 top
U$1  Loveread Lamp v2.0  [A4L-LOC]  -107.5,-65 0 top  (outside the outline)

### Tracks (layer width: path | path; a pad name or v marks a point on that pad's centre or on a via)
3.3V  (via drill 0.33 pad 0.69)  (2 unrouted)
  Top 0.254: 13.96,22.48 U3.8 U3.9 | 13.96,22.48 13.62,22.83 13.62,23.41 14.21,23.91 C13.1 | U3.13 14.62,19.64 12.55,19.64 11.72,20.46 11.72,22.11 11.97,22.36 13.83,22.36 13.96,22.48
  Top 0.305: 14.2,24.82 C13.1 | U2.4 18.92,35.17 19.42,35.67 19.42,36.17 19.77,36.52 20.52,36.52 22.57,38.57 22.97,38.57 L2.P$2 | C12.1 14.43,19.64 14.62,19.64 | C7.1 21.35,25.37 U1.24 | 28.41,18.49 C9.1 28.45,19.27 v28.8,19.33 28.41,19.33 U1.44 | U1.14 27.41,27.51 27.4,27.52 27.4,27.9 27.75,28.25 29.65,28.25 30.05,28.65 C4.1 | C4.1 30.15,28.35 30.8,27.7 32,27.7 32.31,27.39 R21.2 33.16,26.74 33.5,26.4 33.5,24.45 33.15,24.1 31.51,24.1 C2.1 31.26,23.85 30.7,23.85 30.22,23.37 U1.6 | C5.1 18.19,33.12 18.8,32.51 28.96,32.51 30.07,31.41 C4.1 | R8.2 15.93,25.45 15.93,26.42 | 15.93,26.42 R7.2 | 20.83,25.4 v20.83,25.91 | v14.23,26.42 15.93,26.42 | v22.35,19.81 23.37,19.81 23.4,19.78 23.4,19.1 23.88,18.62 C6.1
  Top 0.406: U2.4 18.17,33.66 C5.1 | 18.29,33.54 C5.1 | C5.1 17.39,33.64 14.22,30.48 14.23,30.48 v14.23,26.42 C13.1
  Bottom 0.305: v20.83,25.91 20.32,26.42 17.27,26.42 | 17.27,26.42 v14.23,26.42 | 17.27,26.42 17.27,24.89 v22.35,19.81 22.35,19.3 24.13,19.28 v28.8,19.33
+5V  (via drill 0.33, 0.33 pad 0.69)  (3 unrouted)
  Top 0.406: L1.P$1 21.73,7.26 21.73,8.06 22.07,8.41 22,8.48 22.4,8.88 v22.4,9.33 22.45,9.38 22.45,9.93 U6.5 | U2.1 20.07,38.67 19.52,39.12 18.82,39.12 18.17,38.67 | 18.17,38.67 U2.3 16.9,37.77 C8.1 | C14.A 33.6,18.12 JP2.2 | v17.27,39.12 17.72,39.12 18.17,38.67 | J2.P$1 v6.94,19.64 U5.3 | 16.26,11.68 v15.75,12.19
  Top 0.813: 16.26,11.68 16.76,11.68 18.29,10.16 18.5,9.95 20.75,9.95 C1.1 22.48,9.96 U6.5
  Bottom 0.406: C8.1 16.87,38.71 v17.27,39.12 | 22.99,10.03 23.37,9.65 30.27,10.67 34.3,14.7 34.3,17.41 JP2.2 | 22.99,9.92 v22.4,9.33 | v15.75,12.19 8.3,19.64 v6.94,19.64 | 16.76,37.59 16.76,33.02 6.6,22.86 6.6,20 v6.95,19.65
GND  (via drill 0.33, 0.33 pad 0.69)  (12 unrouted)
  Top 0.254: U3.18 17.96,20.86 | 17.96,20.86 U3.1 | U3.11 17.78,20.94 17.88,20.94 17.96,20.86 | R17.2 9,40.7 9.2,40.5 U9.11 9.2,38.8 9.4,38.6 9.4,38.2 v10.4,38.2 10.7,38.5 10.7,39.3 | U9.10 10.7,39.3 | U9.9 10.8,39.4 10.7,39.3 | v9.5,37.2 9.2,36.9 U9.20 9.2,35.05 8.7,34.55 7.28,34.55 C28.2 | R10.2 40.02,36 U4.11 | v37,34.6 36.7,34.6 36.45,34.35 36.3,34.35 | U4.21 37.05,35.1 36.3,34.35 | 36.3,34.35 35.4,34.35 | U4.9 39.4,33.88 | 39.4,33.88 U4.10 | 35.65,8.05 U8.20 35.65,9.65 35.85,9.85 | 39.9,34.35 39.45,34.35 | 39.45,34.35 38.55,34.35 v38.3,34.6 | 39.4,33.88 39.4,34.3 39.45,34.35 | v37,35.6 36.75,35.85 35,35.85 34.55,36.3 34.55,37.62 CS9.2 | 39.8,35.85 38.55,35.85 v38.3,35.6 | 10.7,35.35 10.7,36.95 10.4,37.25 | 5.15,9.2 6.45,9.2 v6.7,9.45 | 9.55,9.2 8.25,9.2 v8,9.45 | 5.15,10.7 5.65,10.7 | 5.65,10.7 6.55,10.7 v6.75,10.5 6.8,10.45 6.85,10.45 U7.21 | 9.6,10.7 8.2,10.7 7.95,10.45 | U7.9 5.6,10.75 5.65,10.7 | U7.20 10,9.2 10.5,8.7 10.5,7.22 CS19.2 | v34.4,6.3 34.4,5.65 34.2,5.45 | C8.2 17.37,36.47 v18.57,36.47 19.12,37.02 U2.2
  Top 0.305: U1.35 23.9,20.75 24.89,21.74 v24.89,21.84 | v26.92,24.89 26.92,26.75 U1.15 26.9,28.5 27.2,28.8 27.8,28.8 28.37,29.37 | v24.89,24.89 24.89,25.26 24.28,25.87 U1.23 | U1.5 27.95,22.87 v26.92,21.84 27.46,21.84 27.9,21.4 U1.43 | J1.GND 40.28,24.4 39.9,24.4 39.7,24.6 39.7,24.95 37.65,27 34.35,27 34.31,26.96 S1.P$1 | C2.2 31.74,21.84 33.68,21.84 34.49,22.51 S1.P$3 | v17.17,21.16 17.39,20.94 17.78,20.94 | 35.85,9.85 36.77,9.85 37.08,10.16 37.98,10.16 C25.2
  Top 0.406: U8.1 34.15,7.6 U8.21 35.25,6.5 | 35.25,6.5 35.65,6.1 U8.11 35.65,3.45 R14.2 | U8.9 33.85,5.1 34.15,5.4 | U8.10 34.15,5.4 | 34.15,5.4 34.2,5.45 | v34.4,6.3 35.05,6.3 35.25,6.5
  other vias: 9.25,22.9 17.66,17.9 16.22,22.26 16.22,21.16 17.17,22.26 34.4,7.5 35.4,7.5 35.4,6.3 9.5,38.2 10.4,37.2 7.95,10.5 15.15,29.95 5.1,20.25 8.1,17.85 2.04,26.85 11,44 18,43 44,35 17,31 30.17,15.31 30,10.98 28,5.98 13,16.51 2.8,17.2 1,10 26,3 19,2 11.68,26.42 26.92,34.04 25.4,18.29 33.65,21.9
  pour Top (isolate 0.406, rank 2): 0,45 45,45 45,0 0,0
  pour Bottom (isolate 0.406): 0,45 45,45 45,0 0,0
N$1
  Top 0.254: U3.20 19.44,20.94 C11.1
N$5
  Top 0.254: U3.10 12.93,21.45 C10.1
N$6
  Top 0.61: CS17.1 16.25,4.15 | 16.25,4.15 CS10.1 | J4.P$2 16.01,3.91 16.25,4.15
N$8
  Top 0.254: U7.19 9.18,8.22 9.9,8.2 CS14.1
  Top 0.813: CS12.1 11.25,4.1 | 12.25,4.1 13.7,4.1 CP3.1 | CS13.1 CS14.1 11.2,4.15 11.25,4.1 | 11.25,4.1 12.25,4.1 | 12.25,4.1 CP4.1 12.2,4.05 J4.P$1
N$9
  Top 0.305: U4.2 34.67,33.38 33.85,34.2 33.85,36.7 CS1.1
  pour Top (no thermals): 33.25,39.65 33.25,37.35 28.6,37.35 28.6,38.6 26.7,38.6 26.7,39.6
N$10  (2 unrouted)
  Top 1.016: CS.1 29.05,40.85 | 29.05,40.85 27.3,40.85 | 28.99,42.7 28.99,40.91 29.05,40.85
N$11
  Top 0.254: 32.8,41.1 33.55,41.1 CP2.1 | 35.1,36.8 35.1,40.7
  Top 0.305: U4.19 35.1,36.8 | 35.1,40.7 CS4.1
  Top 0.813: CP1.1 32.55,40.85 | 32.55,40.85 CP2.1 CS4.1 CS3.1 CS2.1 | J3.P$1 32.8,41.1 32.55,40.85
N$12
  Top 0.305: CS1.2 32.7,34.4 34.6,32.5 36.4,32.5 U4.3
N$13
  Top 0.254: CS2.2 39.15,42.55 39.55,42.15 39.55,40.15 39.3,39.9 37.1,39.9 36.9,39.7 U4.17
N$14
  Top 0.254: CS3.2 36.85,43.2 37.2,43.55 39.2,43.55 40.05,42.7 40.05,39.8 39.55,39.4 37.6,39.4 37.4,39.2 U4.16
N$15
  Top 0.61: R5.1 31.46,16.73 JP2.1
N$16
  Top 0.254: U7.3 8.6,12.35 8.75,12.5 10.45,12.5 12.3,10.65 CS11.2
N$17
  Top 0.305: R6.2 5.04,25.66 5.04,25.4 U5.5
N$19
  Top 0.254: CS4.2 35.25,42.7 35.05,42.9 35.05,43 35.75,44.1 39.65,44.1 40.65,43.1 40.65,39.5 39.95,38.95 38.05,38.95 37.9,38.8 U4.15
N$20
  Top 0.305: CS6.2 29.15,35.65 34.35,30.25 37.25,30.25 37.9,31.15 U4.6
N$21
  Top 0.305: CS5.2 30.9,34.95 34.7,31.05 37,31.05 37.4,31.6 U4.5
N$22
  Top 0.254: 6.55,2.45 6.25,2.45 | 6.25,2.45 5.85,2.45 5.45,2.85 5.45,4.85 5.7,5.1 7.9,5.1 8.1,5.3 U7.17 | CS12.2 6.3,2.4 6.25,2.45
N$23
  Top 0.254: CS9.1 35.95,37.85 36.4,37.4 U4.18
  Top 0.813: C20.1 CS9.1
N$24
  Top 0.254: U4.12 43.42,36.83 43.65,37.05 43.65,40.05 R9.2
N$25
  Top 0.254: U4.14 38.4,38.25 38.6,38.45 40.3,38.45 R9.1 42.35,38.9 42.35,37.75 R4.2
N$26
  Top 0.254: U4.13 38.9,37.5 39.1,37.7 R10.1
N$27
  Top 0.254: U7.16 7.6,5.8 7.4,5.6 5.45,5.6 4.95,5.2 4.95,2.3 5.8,1.45 7.8,1.45 8.15,1.8 8.15,2.45 CS13.2
N$28
  Top 0.254: U7.15 7.1,6.2 6.95,6.05 5.05,6.05 4.35,5.5 4.35,1.9 5.35,0.9 9.25,0.9 9.95,2 9.95,2.1 9.75,2.3 9.75,2.45 CS14.2
N$29
  Top 0.254: 15.85,9.35 15.85,8.95 CS16.2
  Top 0.305: 15.85,8.85 15.85,9.35 10.7,14.4 7.8,14.4 7.1,13.85 U7.6 7.1,11.62
N$30
  Top 0.254: 14.1,10.05 14.1,9.1 13.75,8.75
  Top 0.305: CS15.2 14.1,10.05 10.3,13.75 8,13.75 7.6,13.4 U7.5 7.6,11.62
N$31
  Top 0.254: U7.2 9.1,11.62
  Top 0.305: 9.1,11.62 10.32,11.62 11.15,10.8 11.15,8.3 CS11.1
  pour Top (no thermals): 11.8,5.3 11.8,7.7 16.25,7.7 16.25,6.4 18.3,5.38 18.3,5.3
N$32
  Top 0.254: 9.05,7.05 9.05,7.15 8.6,7.6 U7.18
  Top 0.813: C22.1 CS19.1 9.05,7.05
N$33
  Top 0.254: U7.12 5.6,8.18 1.73,8.18 1.4,7.9 1.4,4.9 3.3,3.75 R3.2
N$34
  Top 0.254: U7.14 6.6,6.75 6.4,6.55 4.7,6.55 3.3,5.45 | 3.3,5.45 2.65,6.1 2.65,7.25 | 2.65,7.25 2.7,7.3 | 2.65,7.25 R2.2 | 3.3,5.45 R3.1
N$35  (2 unrouted)
  Top 0.254: 6.1,8.18 6.1,7.5 5.9,7.3 4,7.3
N$36  (1 unrouted)
  Top 0.813: 42.5,15.51 J5.P$2
  Top 1.016: CS27.1 40.65,15.45 | 40.65,15.45 40.65,17.2 | 42.5,15.51 40.71,15.51 40.65,15.45
N$37
  Top 0.254: CS22.1 CS23.1 CS24.1 40.45,9.3 37.15,9.3 36.62,8.78 U8.19
  Top 0.813: CP5.1 CP6.1 | CP6.1 40.65,6.2 CS22.1 | J5.P$1 40.75,11.7 CP6.1
N$38
  Top 0.305: U8.3 32.3,8.1 32.3,9.9 34.2,11.8 CS21.2
N$39
  Top 0.254: U8.17 39.55,7.6 39.7,7.45 39.7,5.2 39.95,4.95 41.95,4.95 42.35,5.35 42.35,6.05 42.3,6.1 CS22.2
N$40
  Top 0.254: U8.16 38.9,7.1 39.2,6.8 39.2,4.85 39.65,4.4 42.45,4.4 43.25,5.2 43.25,7.15 42.85,7.55 42.6,7.55 CS23.2
N$41
  Top 0.254: 42.35,9.25 42.5,9.25 42.7,9.45 42.8,9.45 43.08,9.27 | 43.08,9.27 43.9,8.75 43.9,4.85 42.9,3.85 39.3,3.85 38.75,4.55 38.75,6.45 38.6,6.6 U8.15 | CS24.2 42.9,9.45 43.08,9.27
N$42
  Top 0.305: CS26.2 35.45,15.35 30.2,10.4 30.2,7.3 30.95,6.6 U8.6
N$43  (1 unrouted)
  Top 0.305: 35.95,13.6 34.75,13.6 30.75,9.85 30.75,7.55 31.4,7.1 U8.5
N$44
  Top 0.305: U8.2 33.17,9.82 34,10.65 36.5,10.65 CS21.1
  pour Top (no thermals): 39.45,11.25 37.15,11.25 37.15,15.9 38.4,15.9 38.4,17.9 39.5,17.9
N$45
  Top 0.254: U8.18 37.65,8.1 C25.1
  Top 0.61: C25.1 CS29.1
N$46
  Top 0.254: 40.98,2.7 39.9,0.95 36.9,0.95 36.67,1.18 36.67,5.05 U8.12 | 40.98,2.7 41.05,2.8 | R13.2 40.9,2.77 40.98,2.7
N$47
  Top 0.254: U8.14 38.05,6.1 38.25,5.9 38.25,4.2 39.35,2.8 39.3,2.75 | R12.2 37.55,2.15 38.7,2.15 39.3,2.75 | R13.1 39.3,2.75
N$48
  Top 0.254: U8.13 37.4,5.6 37.5,5.5 R14.1
N$49  (1 unrouted)
  Top 0.254: J6.P$2 2.45,29.04 2.5,28.99
  Top 1.016: CS30.1 4.15,29.05 | 4.15,29.05 4.15,27.3 | 2.3,28.99 2.5,28.99 4.09,28.99 4.15,29.05
N$50
  Top 0.254: 3.9,32.8 3.9,33.55 CP8.1 | 4.3,35.1 8.2,35.1 8.18,35.9 U9.19 | J6.P$1 2.45,32.85 2.5,32.8 | CS32.1 arc26 4.15,37.4
  Top 0.305: 4.3,35.1 4.15,35.25
  Top 0.813: 4.15,31.15 CP7.1 4.15,32.55 | 4.15,32.55 CP8.1 CS34.1 4.15,35.25 CS33.1 4.15,37.4 CS32.1 4.15,38.45 | 2.4,32.8 2.5,32.8 3.9,32.8 4.15,32.55
N$51
  Top 0.305: CS31.2 10.6,32.7 12.5,34.6 12.5,36.4 U9.3 11.62,36.4
N$52
  Top 0.254: CS32.2 2.45,39.15 2.85,39.55 4.85,39.55 5.1,39.3 5.1,37.1 5.3,36.9 U9.17
N$53
  Top 0.254: CS33.2 1.8,36.85 1.45,37.2 1.45,39.2 2.3,40.05 5.2,40.05 5.6,39.55 5.6,37.6 5.8,37.4 U9.16
N$54
  Top 0.254: U9.15 6.2,37.9 6.05,38.05 6.05,39.95 5.5,40.65 1.9,40.65 0.9,39.65 0.9,35.75 2,35.05 2.1,35.05 2.3,35.25 2.45,35.25 CS34.2
N$55  (1 unrouted)
  Top 0.305: 8.85,29.15 9.35,29.15 14.8,34.15 14.8,37.15 13.85,37.9 U9.6 11.62,37.9
N$56
  Top 0.305: CS35.2 10.05,30.9 14.25,34.85 14.25,36.8 13.4,37.4 U9.5 11.62,37.4
N$57  (1 unrouted)
  Top 0.305: 11.62,35.9 11.62,34.67 10.8,33.85 8.3,33.85 CS31.1
  pour Top (no thermals): 5.35,33.25 7.7,33.25 7.7,28.7 6.4,28.7 6.4,26.65 5.35,26.65
N$58
  Top 0.254: 7.05,35.95 C28.1 7.6,36.4 U9.18
  Top 0.813: 5.85,35.95 CS39.1 7.05,35.95
N$59
  Top 0.254: 4.13,42.23 5.55,43.7 7.9,43.7 8.18,43.38 8.18,39.4 U9.12 | 4.13,42.23 3.75,41.7 | R16.2 3.7,41.8 4.13,42.23
N$60
  Top 0.254: U9.14 6.75,38.4 6.55,38.6 6.55,40.3 5.45,41.7 6.1,42.35 | 6.1,42.35 7.25,42.35 R15.2 7.5,42.5 | 6.1,42.35 6.05,42.35 R16.1
N$61
  Top 0.254: U9.13 7.5,38.9 7.3,39.1 R17.1
N$63  (2 unrouted)
  Top 0.61: L1.P$2 25.1,7.18
N$65  (1 unrouted)
N$66
  Top 0.61: U2.5 23.07,35.17 L2.P$1
N$73
  Top 0.305: J1.VBUS 38.01,21.77 F2.1
N$74
  Top 0.305: R23.1 38.61,24.89 39.12,24.38 39.12,23.37 39.13,23.37 39.45,23.05 40.3,23.05 J1.D+
N$78
  Top 0.305: R24.1 38.28,23.37 39.2,22.45 40.28,22.45 J1.D-
N$80
  Top 0.254: 30.75,23.1 32.25,23.1 32.55,23.4
  Top 0.305: R23.2 35.56,24.89 35.05,24.38 35.05,24.2 34.25,23.4 32.55,23.4 | U1.4 29.94,22.37 29.99,22.39 30.75,23.1
N$81
  Top 0.305: U1.3 29.92,21.87 30.53,21.21 34.57,21.21 35.2,21.79 35.2,23.06 35.56,23.37 R24.2
PWM  (via drill 0.33, 0.33 pad 0.69)
  Top 0.305: U1.12 29.31,26.77 v29.46,26.92
  Top 0.406: U6.4 22.45,11.88 v22.45,12.58 | 22.35,12.68 v22.45,12.58 | v22.45,12.58 22.45,12.6 21.84,13.21 R1.1
  Bottom 0.305: 21.99,15.06 21.99,16.26 23.01,17.27 28.96,17.27 30.99,19.3 30.99,20.83 29.46,22.35 v29.46,26.92
  Bottom 0.406: 21.99,15.06 21.99,13.04 v22.45,12.58
RGB  (via drill 0.3)
  Top 0.305: U1.28 21.84,23.37 21.84,23.34 21.75,23.25 21.75,22.4 v21.5,21.94 | v29.97,19.81 29.97,18.53 R5.2
  Bottom 0.305: v21.5,21.94 21.5,21.68 22.86,20.32 29.46,20.32 v29.97,19.81
RST  (1 unrouted)
  Top 0.305: U1.13 27.91,27.41 28.2,27.7 29.85,27.7 30.55,26.95 30.55,26.54 R21.1 30.61,25.98 30.99,25.65 31.47,25.65 S1.P$2
SCL  (1 unrouted)
  Top 0.254: U1.18 25.41,27.99 24.85,28.45 23.37,28.45 21.84,27.17 19.86,27.17 19.86,23.01 19.31,22.51 18.81,22.51
  Top 0.305: 19.86,27.17 19.56,27.48 R7.1
SDA  (via drill 0.33 pad 0.69)
  Top 0.254: R8.1 18.51,24.64 | 18.51,24.64 v18.77,24.41 | v18.77,24.41 18.77,23.76 U3.24 | U1.19 24.91,27.34 v24.55,27.7 | v18.77,24.41 18.73,24.41 18.51,24.64
  Bottom 0.254: v24.55,27.7 24.14,27.7 21.34,24.89 19.25,24.89 v18.77,24.41
V_QI1  (via drill 0.33)  (1 unrouted)
  Top 0.254: 6.97,15.85 6.97,15.86 D2.A
  Top 0.305: v6.45,13.55 5.25,13.55 5.15,13.45 4.95,13.45 | v8.4,13.1 8.1,12.8 U7.4 8.1,11.62
  Top 0.406: 4.95,13.45 4.05,12.55 4.05,11.5 | 5.25,13.55 C18.A | 5.15,13.45 5.15,15.1 5.65,15.5 6.94,15.5 D2.A
  Bottom 0.305: v8.4,13.1 7.8,13.55 v6.45,13.55
V_QI2  (via drill 0.33)
  Top 0.305: v38.65,31.45 39.75,31.45 C19.A 40.05,31.55 | v36.55,31.75 36.9,32.2 U4.4
  Top 0.406: 40.05,31.55 40.95,32.45 CS8.1 | D4.A 42.25,29.15 C19.A
  Bottom 0.305: v36.55,31.75 37.2,31.45 v38.65,31.45
V_QI3  (via drill 0.33)
  Top 0.254: D5.A 28.85,1.73 28.95,1.62 | CS28.1 33.35,3.55
  Top 0.305: v31.45,8 32,7.6 U8.4 | 31.35,4.65 31.35,4.45
  Top 0.406: 31.35,4.45 32.25,3.55 33.35,3.55 | 28.95,1.62 28.95,2.25 31.35,4.65 31.25,4.75 C24.A 31.25,5.75 31.1,5.9 v30,4.88
  Bottom 0.305: v31.45,8 31.45,6.7 v30,4.88
V_QI4  (via drill 0.33)  (2 unrouted)
  Top 0.305: v13.55,38.6 13.55,39.75 13.45,39.85 13.45,40.05 | v13.35,36.35 12.8,36.9 11.62,36.9
  Top 0.406: 13.45,40.05 12.55,40.95 CS38.1 11.45,40.95 | 15.85,42.88 D6.A 15.85,42.25 13.45,39.85
  Bottom 0.305: v13.35,36.35 13.55,36.6 v13.55,38.6
V_QI_IN  (1 unrouted)
  Top 0.305: U5.4 8.5,24.45 | 8.5,24.45 9.5,24.45 C15.A | 8.63,25 8.63,24.58 8.5,24.45
  Top 0.406: 8.63,25 8.63,26.68 15.1,32.9 15.55,33.35 | D5.C 27.93,5.03 26.46,3.56 21.34,3.56 20.35,4.54 20.35,4.7 19.95,5 19.95,5.58 11.15,15.4 10.69,15.4 D2.C | 9.5,24.45 9.55,24.45 9.55,24.3 7.8,22.8 7.8,20.2 10.2,18.05 D2.C | 10.2,15.69 D2.C | D4.C 38.95,29.15 38.64,29.16 34.04,29.16 33.54,29.66 33.53,29.66 26.14,37.04 26.02,37.04 26.02,39.85 25.37,40.4 16.73,40.4 D6.C 15.55,39.58 15.55,33.33
VUSB  (via drill 0.33 pad 0.69)
  Top 0.305: U1.7 29.82,23.87 30.35,24.45 30.35,25.01 v30.33,25.14 | v35.02,19.88 35.02,20.63 F2.2
  Bottom 0.305: v35.02,19.88 34.95,19.81 34.04,19.81 30.48,23.37 30.48,24.99 v30.33,25.14
WL_AN
  Top 0.61: 27.29,12.71 D3.C
  Top 0.813: C17.1 27.29,12.71 27.29,15.47 J8.1
WL_CA
  Top 0.813: R20.2 R19.1 23.39,15.22 23.37,15.24 23.37,15.37 23.8,15.8 J8.2

### Text on the board
tNames: GND | RGB | RGB | 5V | + | +
bNames: www.helentronica.com | Loveread Lamp v3.0 / Pero 2016
Document: LED driver: / Better position of C1, C17 and R19 necessary! / Look at the design guidelines at p.11! | Loveread Lamp | v3.0 | Board layout / 14.11.2016 | Pero | Nov. 2016